# Altium schematic sheet Top.SchDoc
size C portrait; Author: E. Sims; Organization: Let's Build Rockets Inc.; SheetNumber: 1; SheetTotal: 8
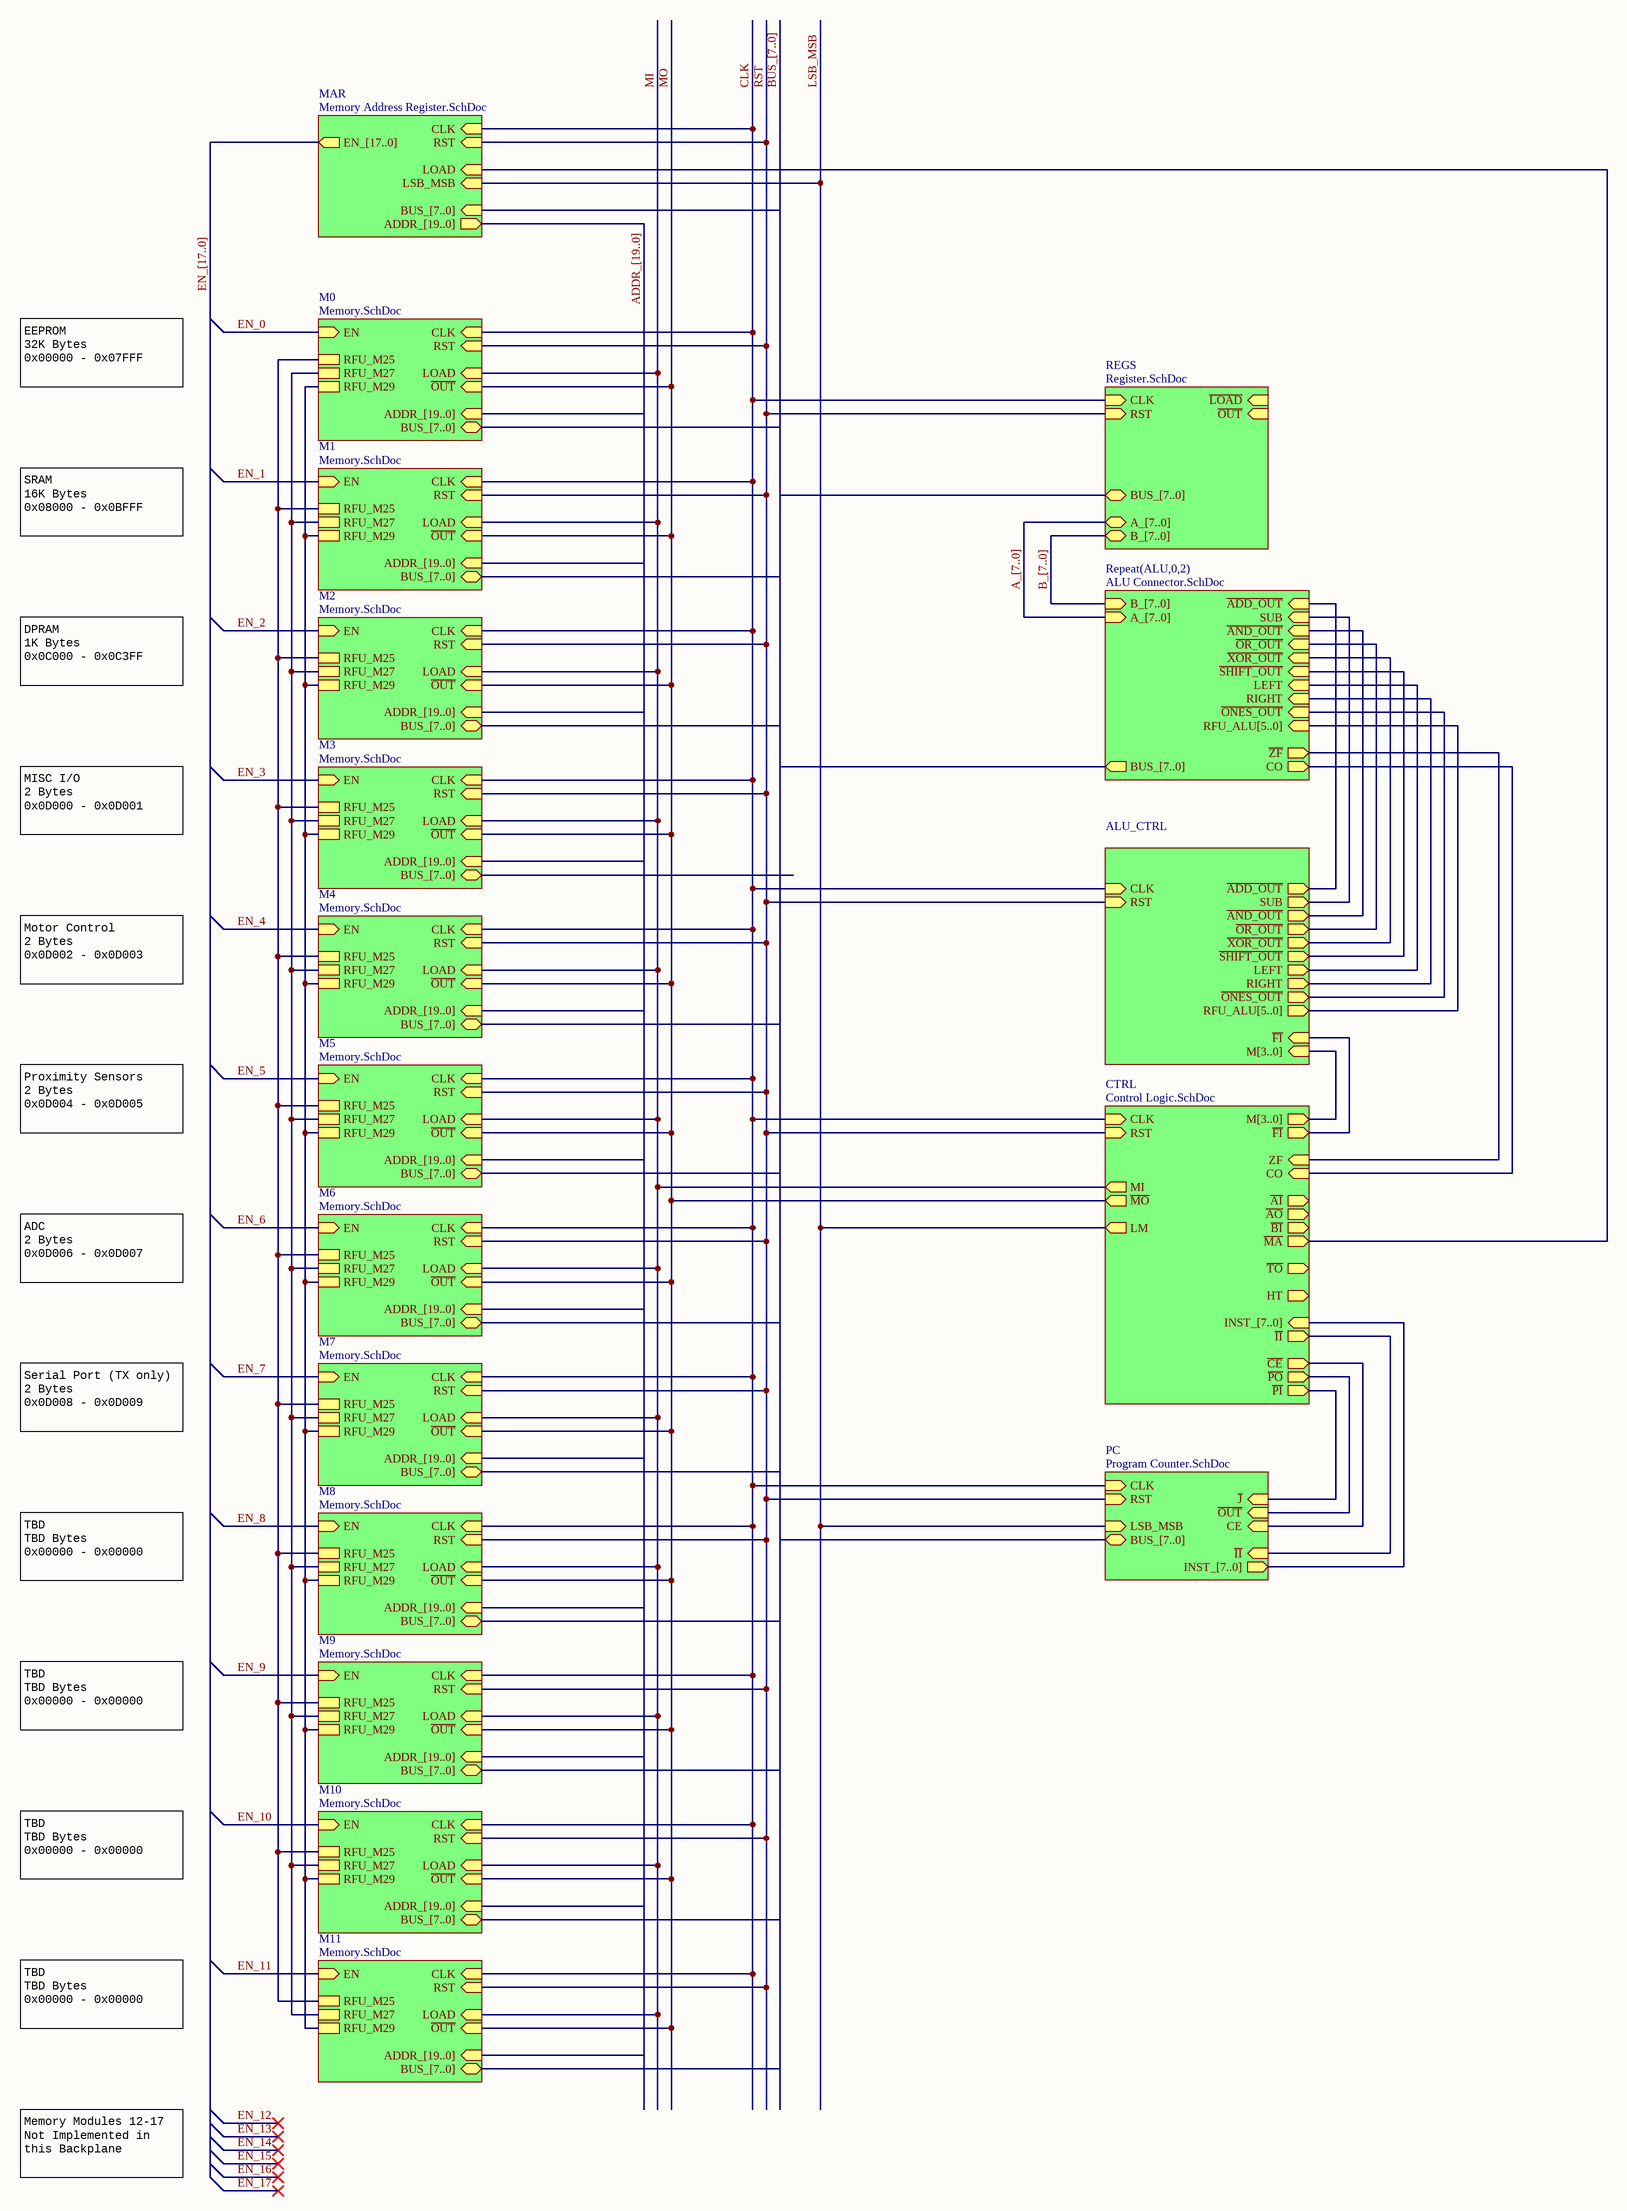
[diagram p0: Top.SchDoc]

## Sub-sheets
ALU_CTRL = ?: CLK (in), RST (in), ~{ONES_OUT} (out), ~{ADD_OUT} (out), LEFT (out), SUB (out), ~{AND_OUT} (out), RIGHT (out), ~{SHIFT_OUT} (out), ~{XOR_OUT} (out), ~{OR_OUT} (out), RFU_ALU[5..0] (out), M[3..0] (in), ~{FI} (in)
CTRL = Control Logic.SchDoc: CLK (in), RST (in), INST_[7..0] (in), ~{AI} (out), MI (out), ~{BI} (out), ~{PI} (out), ~{MO} (out), ~{FI} (out), HT (out), ~{AO} (out), ~{MA} (out), ~{CE} (out), CO (in), ZF (in), LM (out), M[3..0] (out), ~{II} (out), ~{PO} (out), ~{TO} (out)
M0 = Memory.SchDoc: ADDR_[19..0] (in), CLK (in), BUS_[7..0] (bidir), LOAD (in), RST (in), ~{OUT} (in), EN (in), RFU_M29, RFU_M25, RFU_M27
M1 = Memory.SchDoc: CLK (in), BUS_[7..0] (bidir), LOAD (in), RST (in), ~{OUT} (in), EN (in), RFU_M29, RFU_M25, RFU_M27, ADDR_[19..0] (in)
M2 = Memory.SchDoc: CLK (in), BUS_[7..0] (bidir), LOAD (in), RST (in), ~{OUT} (in), EN (in), RFU_M29, RFU_M25, RFU_M27, ADDR_[19..0] (in)
M3 = Memory.SchDoc: CLK (in), BUS_[7..0] (bidir), LOAD (in), RST (in), ~{OUT} (in), EN (in), RFU_M29, RFU_M25, RFU_M27, ADDR_[19..0] (in)
M4 = Memory.SchDoc: CLK (in), BUS_[7..0] (bidir), LOAD (in), RST (in), ~{OUT} (in), EN (in), RFU_M29, RFU_M25, RFU_M27, ADDR_[19..0] (in)
M5 = Memory.SchDoc: CLK (in), BUS_[7..0] (bidir), LOAD (in), RST (in), ~{OUT} (in), EN (in), RFU_M29, RFU_M25, RFU_M27, ADDR_[19..0] (in)
M6 = Memory.SchDoc: CLK (in), BUS_[7..0] (bidir), LOAD (in), RST (in), ~{OUT} (in), EN (in), RFU_M29, RFU_M25, RFU_M27, ADDR_[19..0] (in)
M7 = Memory.SchDoc: CLK (in), BUS_[7..0] (bidir), LOAD (in), RST (in), ~{OUT} (in), EN (in), RFU_M29, RFU_M25, RFU_M27, ADDR_[19..0] (in)
M8 = Memory.SchDoc: CLK (in), BUS_[7..0] (bidir), LOAD (in), RST (in), ~{OUT} (in), EN (in), RFU_M29, RFU_M25, RFU_M27, ADDR_[19..0] (in)
M9 = Memory.SchDoc: CLK (in), BUS_[7..0] (bidir), LOAD (in), RST (in), ~{OUT} (in), EN (in), RFU_M29, RFU_M25, RFU_M27, ADDR_[19..0] (in)
M10 = Memory.SchDoc: CLK (in), BUS_[7..0] (bidir), LOAD (in), RST (in), ~{OUT} (in), EN (in), RFU_M29, RFU_M25, RFU_M27, ADDR_[19..0] (in)
M11 = Memory.SchDoc: CLK (in), BUS_[7..0] (bidir), LOAD (in), RST (in), ~{OUT} (in), EN (in), RFU_M29, RFU_M25, RFU_M27, ADDR_[19..0] (in)
MAR = Memory Address Register.SchDoc: ADDR_[19..0] (out), CLK (in), BUS_[7..0] (in), LOAD (in), RST (in), LSB_MSB (in), EN_[17..0] (out)
PC = Program Counter.SchDoc: LSB_MSB (in), CLK (in), BUS_[7..0] (bidir), RST (in), ~{OUT} (in), ~{J} (in), CE (in), ~{II} (in), INST_[7..0] (out)
REGS = Register.SchDoc: CLK (in), BUS_[7..0] (bidir), RST (in), ~{OUT} (in), ~{LOAD} (in), A_[7..0] (bidir), B_[7..0] (bidir)
Repeat(ALU,0,2) = ALU Connector.SchDoc: CO (out), ~{ONES_OUT} (in), ~{ADD_OUT} (in), LEFT (in), SUB (in), ~{AND_OUT} (in), B_[7..0] (in), RIGHT (in), ~{ZF} (out), BUS_[7..0] (out), ~{SHIFT_OUT} (in), A_[7..0] (in), ~{XOR_OUT} (in), ~{OR_OUT} (in), RFU_ALU[5..0] (in)

## Nets
CLK: sheet REGS/CLK, sheet MAR/CLK, sheet CTRL/CLK, sheet M0/CLK, sheet M1/CLK, sheet M2/CLK, sheet M3/CLK, sheet M4/CLK, sheet M5/CLK, sheet M6/CLK, sheet M7/CLK, sheet M8/CLK, sheet M9/CLK, sheet M10/CLK, sheet M11/CLK, sheet ALU_CTRL/CLK, sheet PC/CLK
EN_0: sheet M0/EN
EN_1: sheet M1/EN
EN_2: sheet M2/EN
EN_3: sheet M3/EN
EN_4: sheet M4/EN
EN_5: sheet M5/EN
EN_6: sheet M6/EN
EN_7: sheet M7/EN
EN_8: sheet M8/EN
EN_9: sheet M9/EN
EN_10: sheet M10/EN
EN_11: sheet M11/EN
LSB_MSB: sheet MAR/LSB_MSB, sheet CTRL/LM, sheet PC/LSB_MSB
MI: sheet CTRL/MI, sheet M0/LOAD, sheet M1/LOAD, sheet M2/LOAD, sheet M3/LOAD, sheet M4/LOAD, sheet M5/LOAD, sheet M6/LOAD, sheet M7/LOAD, sheet M8/LOAD, sheet M9/LOAD, sheet M10/LOAD, sheet M11/LOAD
MO: sheet CTRL/~{MO}, sheet M0/~{OUT}, sheet M1/~{OUT}, sheet M2/~{OUT}, sheet M3/~{OUT}, sheet M4/~{OUT}, sheet M5/~{OUT}, sheet M6/~{OUT}, sheet M7/~{OUT}, sheet M8/~{OUT}, sheet M9/~{OUT}, sheet M10/~{OUT}, sheet M11/~{OUT}
RST: sheet REGS/RST, sheet MAR/RST, sheet CTRL/RST, sheet M0/RST, sheet M1/RST, sheet M2/RST, sheet M3/RST, sheet M4/RST, sheet M5/RST, sheet M6/RST, sheet M7/RST, sheet M8/RST, sheet M9/RST, sheet M10/RST, sheet M11/RST, sheet ALU_CTRL/RST, sheet PC/RST
(unnamed): sheet Repeat(ALU,0,2)/CO, sheet CTRL/CO
(unnamed): sheet Repeat(ALU,0,2)/~{ONES_OUT}, sheet ALU_CTRL/~{ONES_OUT}
(unnamed): sheet Repeat(ALU,0,2)/~{ADD_OUT}, sheet ALU_CTRL/~{ADD_OUT}
(unnamed): sheet Repeat(ALU,0,2)/LEFT, sheet ALU_CTRL/LEFT
(unnamed): sheet Repeat(ALU,0,2)/SUB, sheet ALU_CTRL/SUB
(unnamed): sheet Repeat(ALU,0,2)/~{AND_OUT}, sheet ALU_CTRL/~{AND_OUT}
(unnamed): sheet Repeat(ALU,0,2)/RIGHT, sheet ALU_CTRL/RIGHT
(unnamed): sheet Repeat(ALU,0,2)/~{ZF}, sheet CTRL/ZF
(unnamed): sheet Repeat(ALU,0,2)/~{SHIFT_OUT}, sheet ALU_CTRL/~{SHIFT_OUT}
(unnamed): sheet Repeat(ALU,0,2)/~{XOR_OUT}, sheet ALU_CTRL/~{XOR_OUT}
(unnamed): sheet Repeat(ALU,0,2)/~{OR_OUT}, sheet ALU_CTRL/~{OR_OUT}
(unnamed): sheet MAR/LOAD, sheet CTRL/~{MA}
(unnamed): sheet CTRL/~{PI}, sheet PC/~{J}
(unnamed): sheet CTRL/~{FI}, sheet ALU_CTRL/~{FI}
(unnamed): sheet CTRL/~{CE}, sheet PC/CE
(unnamed): sheet CTRL/~{II}, sheet PC/~{II}
(unnamed): sheet CTRL/~{PO}, sheet PC/~{OUT}
(unnamed): sheet M0/RFU_M29, sheet M1/RFU_M29, sheet M2/RFU_M29, sheet M3/RFU_M29, sheet M4/RFU_M29, sheet M5/RFU_M29, sheet M6/RFU_M29, sheet M7/RFU_M29, sheet M8/RFU_M29, sheet M9/RFU_M29, sheet M10/RFU_M29, sheet M11/RFU_M29
(unnamed): sheet M0/RFU_M25, sheet M1/RFU_M25, sheet M2/RFU_M25, sheet M3/RFU_M25, sheet M4/RFU_M25, sheet M5/RFU_M25, sheet M6/RFU_M25, sheet M7/RFU_M25, sheet M8/RFU_M25, sheet M9/RFU_M25, sheet M10/RFU_M25, sheet M11/RFU_M25
(unnamed): sheet M0/RFU_M27, sheet M1/RFU_M27, sheet M2/RFU_M27, sheet M3/RFU_M27, sheet M4/RFU_M27, sheet M5/RFU_M27, sheet M6/RFU_M27, sheet M7/RFU_M27, sheet M8/RFU_M27, sheet M9/RFU_M27, sheet M10/RFU_M27, sheet M11/RFU_M27

## Buses and harness runs
bus A_[7..0] = sheet REGS/A_[7..0] = sheet Repeat(ALU,0,2)/A_[7..0]
bus ADDR_[19..0] = sheet M0/ADDR_[19..0] = sheet M1/ADDR_[19..0] = sheet M2/ADDR_[19..0] = sheet M3/ADDR_[19..0] = sheet M4/ADDR_[19..0] = sheet M5/ADDR_[19..0] = sheet M6/ADDR_[19..0] = sheet M7/ADDR_[19..0] = sheet M8/ADDR_[19..0] = sheet M9/ADDR_[19..0] = sheet M10/ADDR_[19..0] = sheet M11/ADDR_[19..0] = sheet MAR/ADDR_[19..0]
bus B_[7..0] = sheet REGS/B_[7..0] = sheet Repeat(ALU,0,2)/B_[7..0]
bus BUS_[7..0] = sheet M0/BUS_[7..0] = sheet M1/BUS_[7..0] = sheet M2/BUS_[7..0] = sheet M4/BUS_[7..0] = sheet M5/BUS_[7..0] = sheet M6/BUS_[7..0] = sheet M7/BUS_[7..0] = sheet M8/BUS_[7..0] = sheet M9/BUS_[7..0] = sheet M10/BUS_[7..0] = sheet M11/BUS_[7..0] = sheet MAR/BUS_[7..0] = sheet PC/BUS_[7..0] = sheet REGS/BUS_[7..0] = sheet Repeat(ALU,0,2)/BUS_[7..0]
bus EN_[17..0] = sheet MAR/EN_[17..0]
bus sheet ALU_CTRL/M[3..0] = sheet CTRL/M[3..0]
bus sheet ALU_CTRL/RFU_ALU[5..0] = sheet Repeat(ALU,0,2)/RFU_ALU[5..0]
bus sheet CTRL/INST_[7..0] = sheet PC/INST_[7..0]

## Notes on the sheet
- EEPROM
  32K Bytes
  0x00000 - 0x07FFF
- SRAM
  16K Bytes
  0x08000 - 0x0BFFF
- DPRAM
  1K Bytes
  0x0C000 - 0x0C3FF
- MISC I/O
  2 Bytes
  0x0D000 - 0x0D001
- Motor Control
  2 Bytes
  0x0D002 - 0x0D003
- Proximity Sensors
  2 Bytes
  0x0D004 - 0x0D005
- ADC
  2 Bytes
  0x0D006 - 0x0D007
- Serial Port (TX only)
  2 Bytes
  0x0D008 - 0x0D009
- TBD
  TBD Bytes
  0x00000 - 0x00000
- Memory Modules 12-17 Not Implemented in this Backplane
- Let's Build Rocket's Inc. Modular Paylaod System Based on TMP-010 Rev
  For more information visit https://github.com/LetsBuildRockets/Modular-Payload-System
  This work is licensed under CC BY-NC 4.0. To view a copy of this license, visit https://creativecommons.org/licenses/by-nc/4.0
- Title
- Size:
- Date:
- Assembly Variant:
- B
- Number:
- Time:
- Revision:
- Sheet
- of
- Author:
- File: